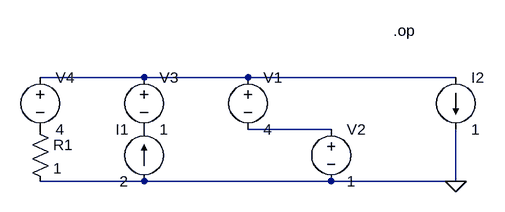
[diagram p0: schematic source_insanity.asc]
source_insanity.asc, the LTspice schematic file:
Version 4
SHEET 1 880 680
WIRE -64 240 -224 240
WIRE 96 240 -64 240
WIRE 416 240 96 240
WIRE 224 320 96 320
WIRE -64 400 -224 400
WIRE 224 400 -64 400
WIRE 416 400 416 320
WIRE 416 400 224 400
FLAG 416 400 0
SYMBOL voltage -64 224 R0
SYMATTR InstName V3
SYMATTR Value 1
SYMBOL current -64 400 R180
WINDOW 0 24 80 Left 2
WINDOW 3 24 0 Left 2
SYMATTR InstName I1
SYMATTR Value 2
SYMBOL voltage -224 224 R0
SYMATTR InstName V4
SYMATTR Value 4
SYMBOL res -240 304 R0
SYMATTR InstName R1
SYMATTR Value 1
SYMBOL current 416 240 R0
SYMATTR InstName I2
SYMATTR Value 1
SYMBOL voltage 224 304 R0
SYMATTR InstName V2
SYMATTR Value 1
SYMBOL voltage 96 224 R0
SYMATTR InstName V1
SYMATTR Value 4
TEXT 320 168 Left 2 !.op

The netlist it stands for:
* source_insanity.asc
V3 N001 P001 1
I1 0 P001 2
V4 N001 P002 4
R1 P002 0 1
I2 N001 0 1
V2 N002 0 1
V1 N001 N002 4
.op
.backanno
.end